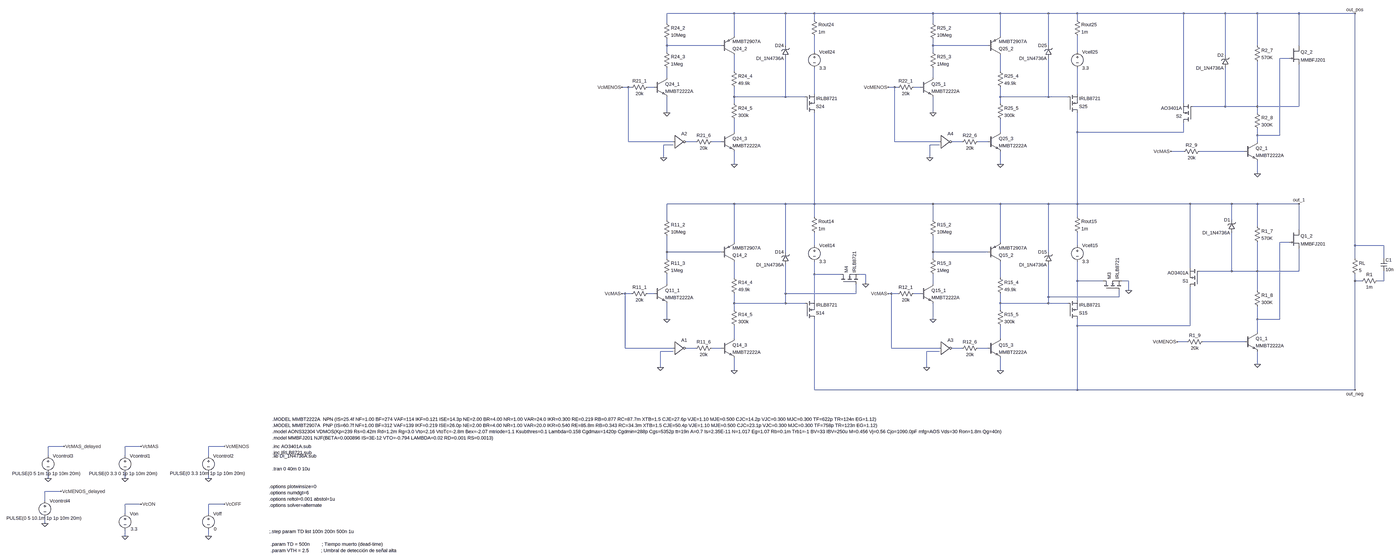
[diagram p0: schematic Matriz2x2_con_inversores.asc, whole sheet]
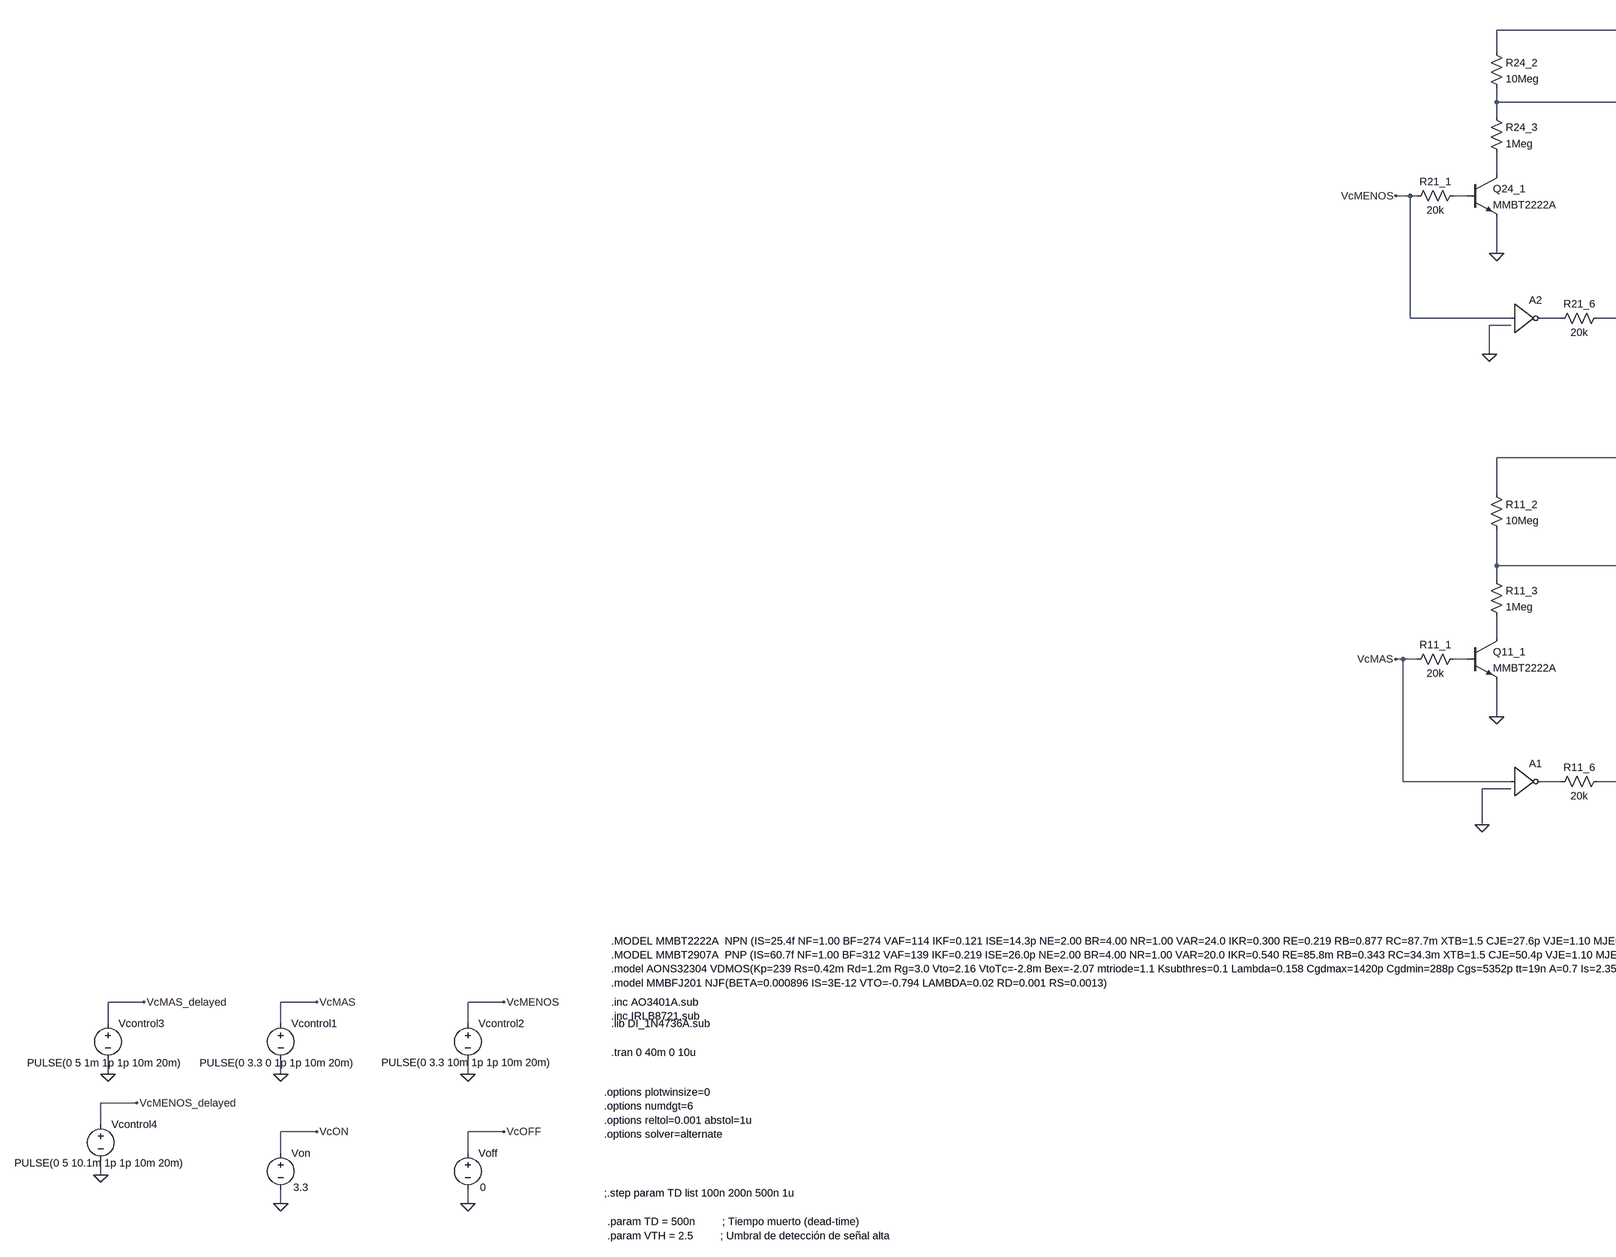
[diagram p1: schematic Matriz2x2_con_inversores.asc, part, row 1 of 1, column 1 of 2]
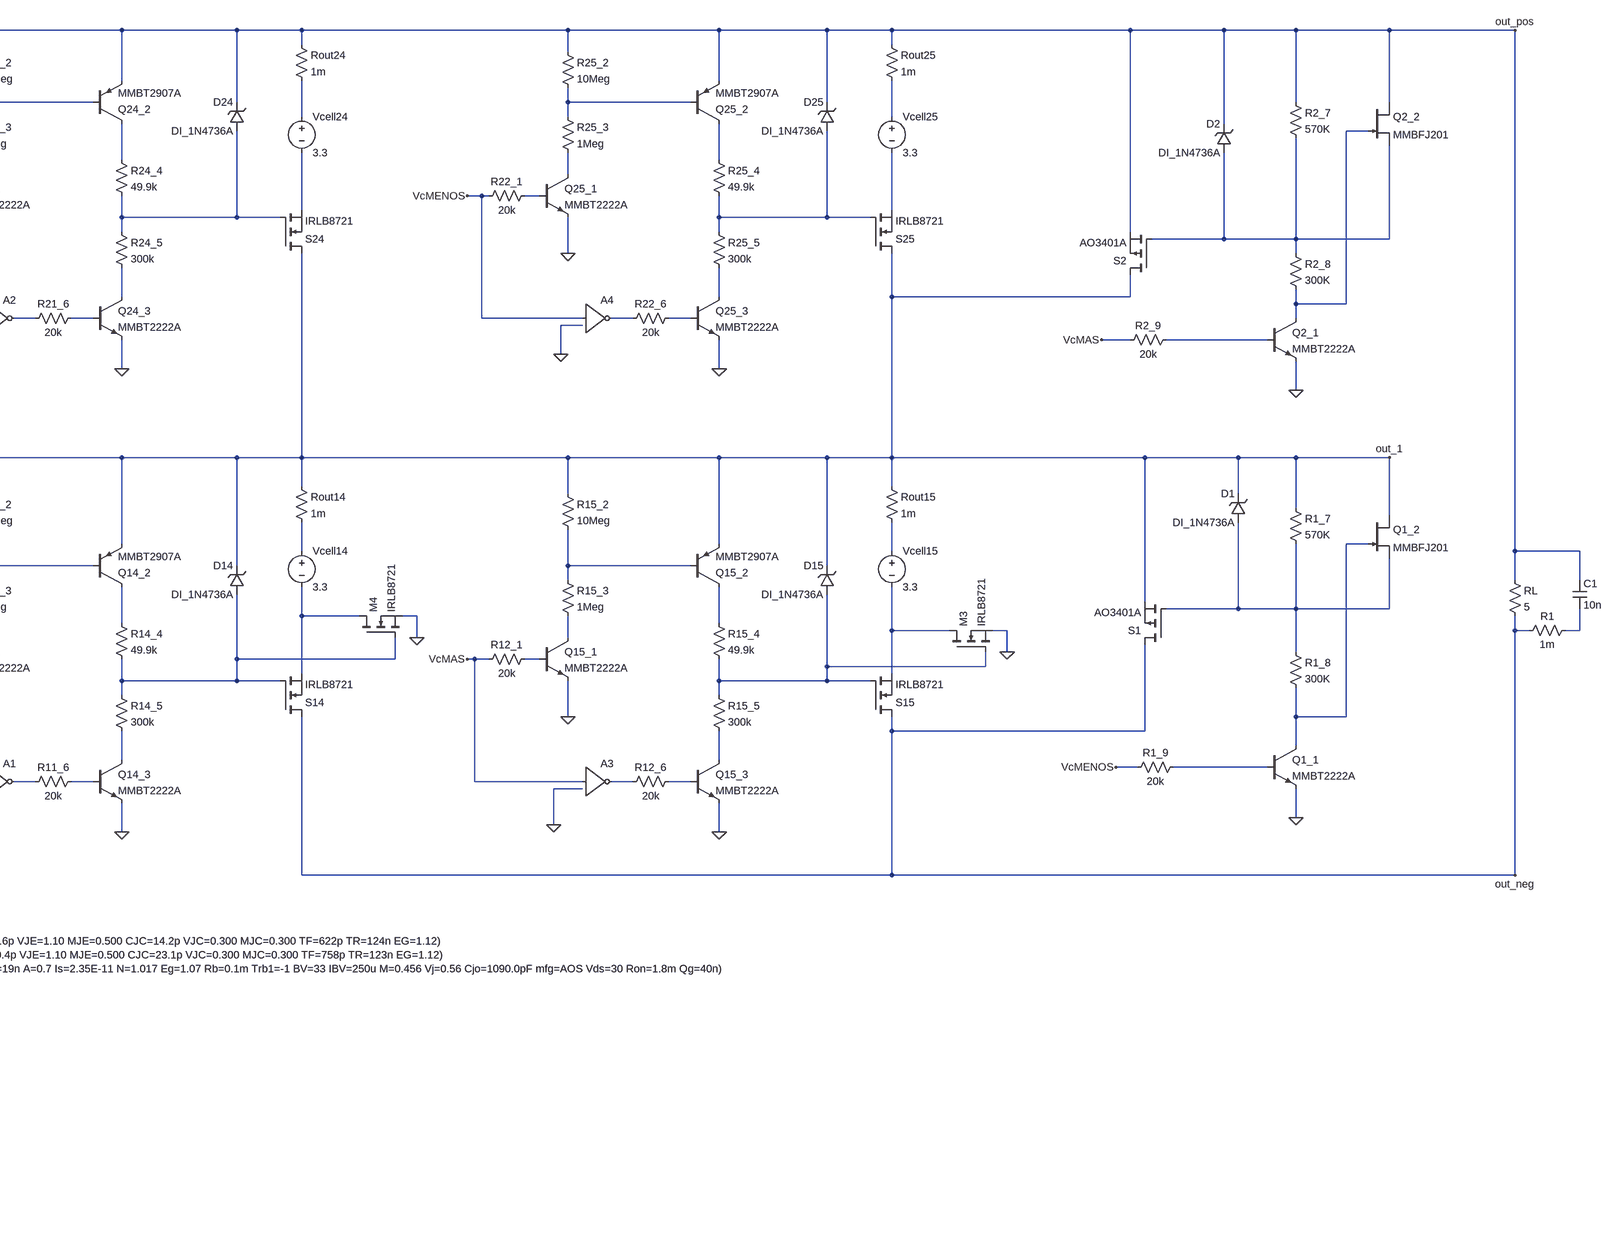
[diagram p2: schematic Matriz2x2_con_inversores.asc, part, row 1 of 1, column 2 of 2]
Matriz2x2_con_inversores.asc, the LTspice schematic file:
Version 4.1
SHEET 1 5536 2128
WIRE -800 -1456 -1136 -1456
WIRE -544 -1456 -800 -1456
WIRE -400 -1456 -544 -1456
WIRE 192 -1456 -400 -1456
WIRE 528 -1456 192 -1456
WIRE 768 -1456 528 -1456
WIRE 912 -1456 768 -1456
WIRE 1712 -1456 912 -1456
WIRE 1920 -1456 1712 -1456
WIRE 2080 -1456 1920 -1456
WIRE 2288 -1456 2080 -1456
WIRE 2592 -1456 2288 -1456
WIRE -400 -1424 -400 -1456
WIRE 912 -1424 912 -1456
WIRE -1136 -1408 -1136 -1456
WIRE 192 -1408 192 -1456
WIRE -800 -1344 -800 -1456
WIRE 528 -1344 528 -1456
WIRE -1136 -1296 -1136 -1328
WIRE -864 -1296 -1136 -1296
WIRE -544 -1296 -544 -1456
WIRE 192 -1296 192 -1328
WIRE 464 -1296 192 -1296
WIRE 768 -1296 768 -1456
WIRE 2080 -1296 2080 -1456
WIRE 2288 -1296 2288 -1456
WIRE -1136 -1264 -1136 -1296
WIRE -400 -1264 -400 -1344
WIRE 192 -1264 192 -1296
WIRE 912 -1264 912 -1344
WIRE 1920 -1248 1920 -1456
WIRE 2240 -1232 2192 -1232
WIRE -800 -1168 -800 -1248
WIRE 528 -1168 528 -1248
WIRE -1136 -1136 -1136 -1184
WIRE 192 -1136 192 -1184
WIRE -1328 -1088 -1360 -1088
WIRE -1312 -1088 -1328 -1088
WIRE -1200 -1088 -1232 -1088
WIRE 0 -1088 -32 -1088
WIRE 16 -1088 0 -1088
WIRE 128 -1088 96 -1088
WIRE -400 -1056 -400 -1184
WIRE 912 -1056 912 -1184
WIRE -800 -1040 -800 -1088
WIRE -544 -1040 -544 -1232
WIRE -544 -1040 -800 -1040
WIRE -448 -1040 -544 -1040
WIRE 528 -1040 528 -1088
WIRE 768 -1040 768 -1232
WIRE 768 -1040 528 -1040
WIRE 864 -1040 768 -1040
WIRE -800 -1008 -800 -1040
WIRE 528 -1008 528 -1040
WIRE 1712 -1008 1712 -1456
WIRE 1920 -992 1920 -1184
WIRE 1920 -992 1760 -992
WIRE 2080 -992 2080 -1216
WIRE 2080 -992 1920 -992
WIRE 2288 -992 2288 -1200
WIRE 2288 -992 2080 -992
WIRE -1136 -960 -1136 -1040
WIRE 192 -960 192 -1040
WIRE 2080 -960 2080 -992
WIRE -800 -864 -800 -928
WIRE 528 -864 528 -928
WIRE 912 -864 912 -960
WIRE 1712 -864 1712 -912
WIRE 1712 -864 912 -864
WIRE 2080 -848 2080 -880
WIRE 2192 -848 2192 -1232
WIRE 2192 -848 2080 -848
WIRE -1328 -816 -1328 -1088
WIRE -1104 -816 -1328 -816
WIRE -992 -816 -1040 -816
WIRE -864 -816 -912 -816
WIRE 0 -816 0 -1088
WIRE 224 -816 0 -816
WIRE 336 -816 288 -816
WIRE 464 -816 416 -816
WIRE 2080 -816 2080 -848
WIRE -1104 -800 -1152 -800
WIRE 224 -800 176 -800
WIRE 1712 -768 1648 -768
WIRE 2016 -768 1792 -768
WIRE -1152 -736 -1152 -800
WIRE 176 -736 176 -800
WIRE -800 -704 -800 -768
WIRE 528 -704 528 -768
WIRE 2080 -656 2080 -720
WIRE -800 -368 -1136 -368
WIRE -544 -368 -800 -368
WIRE -400 -368 -400 -960
WIRE -400 -368 -544 -368
WIRE 192 -368 -400 -368
WIRE 528 -368 192 -368
WIRE 768 -368 528 -368
WIRE 912 -368 912 -864
WIRE 912 -368 768 -368
WIRE 1744 -368 912 -368
WIRE 1952 -368 1744 -368
WIRE 2080 -368 1952 -368
WIRE 2288 -368 2080 -368
WIRE -400 -304 -400 -368
WIRE 912 -304 912 -368
WIRE -1136 -288 -1136 -368
WIRE 192 -288 192 -368
WIRE 1952 -288 1952 -368
WIRE 2080 -256 2080 -368
WIRE 2288 -240 2288 -368
WIRE -800 -176 -800 -368
WIRE 528 -176 528 -368
WIRE 2240 -176 2192 -176
WIRE -400 -160 -400 -224
WIRE 912 -160 912 -224
WIRE 2592 -160 2592 -1456
WIRE 2736 -160 2592 -160
WIRE -1136 -128 -1136 -208
WIRE -864 -128 -1136 -128
WIRE -544 -128 -544 -368
WIRE 192 -128 192 -208
WIRE 464 -128 192 -128
WIRE 768 -128 768 -368
WIRE -1136 -96 -1136 -128
WIRE 192 -96 192 -128
WIRE 2592 -96 2592 -160
WIRE 2736 -96 2736 -160
WIRE 1744 -48 1744 -368
WIRE 1952 -32 1952 -224
WIRE 1952 -32 1792 -32
WIRE 2080 -32 2080 -176
WIRE 2080 -32 1952 -32
WIRE 2288 -32 2288 -144
WIRE 2288 -32 2080 -32
WIRE -400 -16 -400 -80
WIRE -272 -16 -400 -16
WIRE -144 -16 -176 -16
WIRE -800 0 -800 -80
WIRE 528 0 528 -80
WIRE 912 16 912 -80
WIRE 1040 16 912 16
WIRE 1168 16 1136 16
WIRE 2592 16 2592 -16
WIRE 2624 16 2592 16
WIRE 2736 16 2736 -32
WIRE 2736 16 2704 16
WIRE -1136 32 -1136 -16
WIRE -144 32 -144 -16
WIRE 192 32 192 -16
WIRE 1168 64 1168 16
WIRE 2080 64 2080 -32
WIRE -1344 80 -1360 80
WIRE -1312 80 -1344 80
WIRE -1200 80 -1232 80
WIRE -544 80 -544 -64
WIRE -192 80 -192 32
WIRE -192 80 -544 80
WIRE -16 80 -32 80
WIRE 16 80 -16 80
WIRE 128 80 96 80
WIRE 768 96 768 -64
WIRE 1120 96 1120 64
WIRE 1120 96 768 96
WIRE -400 112 -400 -16
WIRE 912 112 912 16
WIRE -800 128 -800 80
WIRE -544 128 -544 80
WIRE -544 128 -800 128
WIRE -448 128 -544 128
WIRE 528 128 528 80
WIRE 768 128 768 96
WIRE 768 128 528 128
WIRE 864 128 768 128
WIRE -800 160 -800 128
WIRE 528 160 528 128
WIRE -1136 208 -1136 128
WIRE 192 208 192 128
WIRE 2080 208 2080 144
WIRE 2192 208 2192 -176
WIRE 2192 208 2080 208
WIRE 912 240 912 208
WIRE 1744 240 1744 48
WIRE 1744 240 912 240
WIRE 2080 272 2080 208
WIRE -800 304 -800 240
WIRE 528 304 528 240
WIRE 1728 320 1680 320
WIRE 2016 320 1808 320
WIRE -1344 352 -1344 80
WIRE -1104 352 -1344 352
WIRE -992 352 -1040 352
WIRE -864 352 -912 352
WIRE -16 352 -16 80
WIRE 224 352 -16 352
WIRE 336 352 288 352
WIRE 464 352 416 352
WIRE -1104 368 -1168 368
WIRE 224 368 160 368
WIRE 2080 432 2080 368
WIRE -1168 448 -1168 368
WIRE 160 448 160 368
WIRE -800 464 -800 400
WIRE 528 464 528 400
WIRE -400 560 -400 208
WIRE 912 560 912 240
WIRE 912 560 -400 560
WIRE 2592 560 2592 16
WIRE 2592 560 912 560
WIRE -4336 992 -4416 992
WIRE -3952 992 -4032 992
WIRE -3536 992 -3616 992
WIRE -4416 1040 -4416 992
WIRE -4032 1040 -4032 992
WIRE -3616 1040 -3616 992
WIRE -4416 1152 -4416 1120
WIRE -4032 1152 -4032 1120
WIRE -3616 1152 -3616 1120
WIRE -4352 1216 -4432 1216
WIRE -4432 1264 -4432 1216
WIRE -3952 1280 -4032 1280
WIRE -3536 1280 -3616 1280
WIRE -4032 1328 -4032 1280
WIRE -3616 1328 -3616 1280
WIRE -4432 1376 -4432 1344
WIRE -4032 1440 -4032 1408
WIRE -3616 1440 -3616 1408
FLAG -1136 208 0
FLAG -800 464 0
FLAG 192 208 0
FLAG 528 464 0
FLAG -1136 -960 0
FLAG -800 -704 0
FLAG 192 -960 0
FLAG 528 -704 0
FLAG -4032 1152 0
FLAG -3616 1152 0
FLAG -3952 992 VcMAS
FLAG -3536 992 VcMENOS
FLAG -3616 1440 0
FLAG -3536 1280 VcOFF
FLAG -4032 1440 0
FLAG -3952 1280 VcON
FLAG -1360 80 VcMAS
FLAG -1360 -1088 VcMENOS
FLAG -32 -1088 VcMENOS
FLAG -32 80 VcMAS
FLAG 2592 560 out_neg
FLAG 2288 -368 out_1
FLAG 2080 432 0
FLAG 1680 320 VcMENOS
FLAG 2080 -656 0
FLAG 1648 -768 VcMAS
FLAG 2592 -1456 out_pos
FLAG -4416 1152 0
FLAG -4336 992 VcMAS_delayed
FLAG -4432 1376 0
FLAG -4352 1216 VcMENOS_delayed
FLAG 1168 64 0
FLAG -144 32 0
FLAG -1168 448 0
FLAG -1152 -736 0
FLAG 160 448 0
FLAG 176 -736 0
SYMBOL npn -864 304 R0
SYMATTR InstName Q14_3
SYMATTR Value MMBT2222A
SYMBOL res -816 144 R0
SYMATTR InstName R14_5
SYMATTR Value 300k
SYMBOL res -816 -16 R0
SYMATTR InstName R14_4
SYMATTR Value 49.9k
SYMBOL npn -1200 32 R0
SYMATTR InstName Q11_1
SYMATTR Value MMBT2222A
SYMBOL res -1152 -112 R0
SYMATTR InstName R11_3
SYMATTR Value 1Meg
SYMBOL res -1152 -304 R0
SYMATTR InstName R11_2
SYMATTR Value 10Meg
SYMBOL res -896 336 R90
WINDOW 0 0 56 VBottom 2
WINDOW 3 32 56 VTop 2
SYMATTR InstName R11_6
SYMATTR Value 20k
SYMBOL voltage -400 -176 R0
WINDOW 123 0 0 Left 0
WINDOW 39 0 0 Left 0
SYMATTR InstName Vcell14
SYMATTR Value 3.3
SYMBOL pnp -864 -80 M180
SYMATTR InstName Q14_2
SYMATTR Value MMBT2907A
SYMBOL nmos -448 208 M180
SYMATTR InstName S14
SYMATTR Value IRLB8721
SYMATTR Prefix X
SYMBOL npn 464 304 R0
SYMATTR InstName Q15_3
SYMATTR Value MMBT2222A
SYMBOL res 512 144 R0
SYMATTR InstName R15_5
SYMATTR Value 300k
SYMBOL res 512 -16 R0
SYMATTR InstName R15_4
SYMATTR Value 49.9k
SYMBOL npn 128 32 R0
SYMATTR InstName Q15_1
SYMATTR Value MMBT2222A
SYMBOL res 176 -112 R0
SYMATTR InstName R15_3
SYMATTR Value 1Meg
SYMBOL res 176 -304 R0
SYMATTR InstName R15_2
SYMATTR Value 10Meg
SYMBOL res 432 336 R90
WINDOW 0 0 56 VBottom 2
WINDOW 3 32 56 VTop 2
SYMATTR InstName R12_6
SYMATTR Value 20k
SYMBOL voltage 912 -176 R0
WINDOW 123 0 0 Left 0
WINDOW 39 0 0 Left 0
SYMATTR InstName Vcell15
SYMATTR Value 3.3
SYMBOL pnp 464 -80 M180
SYMATTR InstName Q15_2
SYMATTR Value MMBT2907A
SYMBOL nmos 864 208 M180
SYMATTR InstName S15
SYMATTR Value IRLB8721
SYMATTR Prefix X
SYMBOL npn -864 -864 R0
SYMATTR InstName Q24_3
SYMATTR Value MMBT2222A
SYMBOL res -816 -1024 R0
SYMATTR InstName R24_5
SYMATTR Value 300k
SYMBOL res -816 -1184 R0
SYMATTR InstName R24_4
SYMATTR Value 49.9k
SYMBOL npn -1200 -1136 R0
SYMATTR InstName Q24_1
SYMATTR Value MMBT2222A
SYMBOL res -1152 -1280 R0
SYMATTR InstName R24_3
SYMATTR Value 1Meg
SYMBOL res -1152 -1424 R0
SYMATTR InstName R24_2
SYMATTR Value 10Meg
SYMBOL res -896 -832 R90
WINDOW 0 0 56 VBottom 2
WINDOW 3 32 56 VTop 2
SYMATTR InstName R21_6
SYMATTR Value 20k
SYMBOL voltage -400 -1280 R0
WINDOW 123 0 0 Left 0
WINDOW 39 0 0 Left 0
SYMATTR InstName Vcell24
SYMATTR Value 3.3
SYMBOL pnp -864 -1248 M180
SYMATTR InstName Q24_2
SYMATTR Value MMBT2907A
SYMBOL nmos -448 -960 M180
SYMATTR InstName S24
SYMATTR Value IRLB8721
SYMATTR Prefix X
SYMBOL npn 464 -864 R0
SYMATTR InstName Q25_3
SYMATTR Value MMBT2222A
SYMBOL res 512 -1024 R0
SYMATTR InstName R25_5
SYMATTR Value 300k
SYMBOL res 512 -1184 R0
SYMATTR InstName R25_4
SYMATTR Value 49.9k
SYMBOL npn 128 -1136 R0
SYMATTR InstName Q25_1
SYMATTR Value MMBT2222A
SYMBOL res 176 -1280 R0
SYMATTR InstName R25_3
SYMATTR Value 1Meg
SYMBOL res 176 -1424 R0
SYMATTR InstName R25_2
SYMATTR Value 10Meg
SYMBOL res 432 -832 R90
WINDOW 0 0 56 VBottom 2
WINDOW 3 32 56 VTop 2
SYMATTR InstName R22_6
SYMATTR Value 20k
SYMBOL voltage 912 -1280 R0
WINDOW 123 0 0 Left 0
WINDOW 39 0 0 Left 0
SYMATTR InstName Vcell25
SYMATTR Value 3.3
SYMBOL pnp 464 -1248 M180
SYMATTR InstName Q25_2
SYMATTR Value MMBT2907A
SYMBOL nmos 864 -960 M180
SYMATTR InstName S25
SYMATTR Value IRLB8721
SYMATTR Prefix X
SYMBOL voltage -4032 1024 R0
WINDOW 3 -180 103 Left 2
WINDOW 123 0 0 Left 0
WINDOW 39 0 0 Left 0
SYMATTR Value PULSE(0 3.3 0 1p 1p 10m 20m)
SYMATTR InstName Vcontrol1
SYMBOL voltage -3616 1024 R0
WINDOW 3 -192 102 Left 2
WINDOW 123 0 0 Left 0
WINDOW 39 0 0 Left 0
SYMATTR Value PULSE(0 3.3 10m 1p 1p 10m 20m)
SYMATTR InstName Vcontrol2
SYMBOL voltage -3616 1312 R0
WINDOW 3 27 92 Left 2
WINDOW 123 0 0 Left 0
WINDOW 39 0 0 Left 0
SYMATTR Value 0
SYMATTR InstName Voff
SYMBOL voltage -4032 1312 R0
WINDOW 3 28 92 Left 2
WINDOW 123 0 0 Left 0
WINDOW 39 0 0 Left 0
SYMATTR Value 3.3
SYMATTR InstName Von
SYMBOL res -1216 64 R90
WINDOW 0 0 56 VBottom 2
WINDOW 3 32 56 VTop 2
SYMATTR InstName R11_1
SYMATTR Value 20k
SYMBOL res -1216 -1104 R90
WINDOW 0 0 56 VBottom 2
WINDOW 3 32 56 VTop 2
SYMATTR InstName R21_1
SYMATTR Value 20k
SYMBOL res 112 -1104 R90
WINDOW 0 0 56 VBottom 2
WINDOW 3 32 56 VTop 2
SYMATTR InstName R22_1
SYMATTR Value 20k
SYMBOL res 112 64 R90
WINDOW 0 0 56 VBottom 2
WINDOW 3 32 56 VTop 2
SYMATTR InstName R12_1
SYMATTR Value 20k
SYMBOL res 2576 -112 R0
SYMATTR InstName RL
SYMATTR Value 5
SYMBOL res 896 -320 R0
SYMATTR InstName Rout15
SYMATTR Value 1m
SYMBOL res -416 -320 R0
SYMATTR InstName Rout14
SYMATTR Value 1m
SYMBOL res -416 -1440 R0
SYMATTR InstName Rout24
SYMATTR Value 1m
SYMBOL res 896 -1440 R0
SYMATTR InstName Rout25
SYMATTR Value 1m
SYMBOL npn 2016 272 R0
SYMATTR InstName Q1_1
SYMATTR Value MMBT2222A
SYMBOL res 1824 304 R90
WINDOW 0 0 56 VBottom 2
WINDOW 3 32 56 VTop 2
SYMATTR InstName R1_9
SYMATTR Value 20k
SYMBOL res 2064 48 R0
SYMATTR InstName R1_8
SYMATTR Value 300K
SYMBOL res 2064 -272 R0
SYMATTR InstName R1_7
SYMATTR Value 570K
SYMBOL npn 2016 -816 R0
SYMATTR InstName Q2_1
SYMATTR Value MMBT2222A
SYMBOL res 1808 -784 R90
WINDOW 0 0 56 VBottom 2
WINDOW 3 32 56 VTop 2
SYMATTR InstName R2_9
SYMATTR Value 20k
SYMBOL res 2064 -976 R0
SYMATTR InstName R2_8
SYMATTR Value 300K
SYMBOL res 2064 -1312 R0
SYMATTR InstName R2_7
SYMATTR Value 570K
SYMBOL pmos 1792 48 R180
SYMATTR InstName S1
SYMATTR Value AO3401A
SYMATTR Prefix X
SYMBOL pmos 1760 -912 R180
SYMATTR InstName S2
SYMATTR Value AO3401A
SYMATTR Prefix X
SYMBOL njf 2240 -240 R0
SYMATTR InstName Q1_2
SYMATTR Value MMBFJ201
SYMBOL njf 2240 -1296 R0
SYMATTR InstName Q2_2
SYMATTR Value MMBFJ201
SYMBOL zener 1936 -1184 R180
WINDOW 0 24 64 Left 2
WINDOW 3 24 0 Left 2
SYMATTR InstName D2
SYMATTR Value DI_1N4736A
SYMATTR Prefix x
SYMBOL zener 784 -1232 R180
WINDOW 0 24 64 Left 2
WINDOW 3 24 0 Left 2
SYMATTR InstName D25
SYMATTR Value DI_1N4736A
SYMATTR Prefix X
SYMBOL zener -528 -1232 R180
WINDOW 0 24 64 Left 2
WINDOW 3 24 0 Left 2
SYMATTR InstName D24
SYMATTR Value DI_1N4736A
SYMATTR Prefix X
SYMBOL zener -528 -64 R180
WINDOW 0 24 64 Left 2
WINDOW 3 24 0 Left 2
SYMATTR InstName D14
SYMATTR Value DI_1N4736A
SYMATTR Prefix X
SYMBOL zener 784 -64 R180
WINDOW 0 24 64 Left 2
WINDOW 3 24 0 Left 2
SYMATTR InstName D15
SYMATTR Value DI_1N4736A
SYMATTR Prefix X
SYMBOL zener 1968 -224 R180
WINDOW 0 24 64 Left 2
WINDOW 3 24 0 Left 2
SYMATTR InstName D1
SYMATTR Value DI_1N4736A
SYMATTR Prefix x
SYMBOL voltage -4416 1024 R0
WINDOW 3 -180 103 Left 2
WINDOW 123 0 0 Left 0
WINDOW 39 0 0 Left 0
SYMATTR Value PULSE(0 5 1m 1p 1p 10m 20m)
SYMATTR InstName Vcontrol3
SYMBOL voltage -4432 1248 R0
WINDOW 3 -192 102 Left 2
WINDOW 123 0 0 Left 0
WINDOW 39 0 0 Left 0
SYMATTR Value PULSE(0 5 10.1m 1p 1p 10m 20m)
SYMATTR InstName Vcontrol4
SYMBOL nmos 1040 64 R270
SYMATTR InstName M3
SYMATTR Value IRLB8721
SYMATTR Prefix X
SYMBOL nmos -272 32 R270
SYMATTR InstName M4
SYMATTR Value IRLB8721
SYMATTR Prefix X
SYMBOL Digital\\inv -1104 288 R0
SYMATTR InstName A1
SYMBOL Digital\\inv -1104 -880 R0
SYMATTR InstName A2
SYMBOL Digital\\inv 224 288 R0
SYMATTR InstName A3
SYMBOL Digital\\inv 224 -880 R0
SYMATTR InstName A4
SYMBOL cap 2720 -96 R0
SYMATTR InstName C1
SYMATTR Value 10n
SYMBOL res 2720 0 R90
WINDOW 0 0 56 VBottom 2
WINDOW 3 32 56 VTop 2
SYMATTR InstName R1
SYMATTR Value 1m
TEXT -3104 1104 Left 2 !.tran 0 40m 0 10u
TEXT -3104 856 Left 2 !.MODEL MMBT2222A  NPN (IS=25.4f NF=1.00 BF=274 VAF=114 IKF=0.121 ISE=14.3p NE=2.00 BR=4.00 NR=1.00 VAR=24.0 IKR=0.300 RE=0.219 RB=0.877 RC=87.7m XTB=1.5 CJE=27.6p VJE=1.10 MJE=0.500 CJC=14.2p VJC=0.300 MJC=0.300 TF=622p TR=124n EG=1.12)\n.MODEL MMBT2907A  PNP (IS=60.7f NF=1.00 BF=312 VAF=139 IKF=0.219 ISE=26.0p NE=2.00 BR=4.00 NR=1.00 VAR=20.0 IKR=0.540 RE=85.8m RB=0.343 RC=34.3m XTB=1.5 CJE=50.4p VJE=1.10 MJE=0.500 CJC=23.1p VJC=0.300 MJC=0.300 TF=758p TR=123n EG=1.12)\n.model AONS32304 VDMOS(Kp=239 Rs=0.42m Rd=1.2m Rg=3.0 Vto=2.16 VtoTc=-2.8m Bex=-2.07 mtriode=1.1 Ksubthres=0.1 Lambda=0.158 Cgdmax=1420p Cgdmin=288p Cgs=5352p tt=19n A=0.7 Is=2.35E-11 N=1.017 Eg=1.07 Rb=0.1m Trb1=-1 BV=33 IBV=250u M=0.456 Vj=0.56 Cjo=1090.0pF mfg=AOS Vds=30 Ron=1.8m Qg=40n)\n.model MMBFJ201 NJF(BETA=0.000896 IS=3E-12 VTO=-0.794 LAMBDA=0.02 RD=0.001 RS=0.0013)
TEXT -3104 992 Left 2 !.inc AO3401A.sub\n.inc IRLB8721.sub
TEXT -3104 1040 Left 2 !.lib DI_1N4736A.sub
TEXT -3120 1192 Left 2 !.options plotwinsize=0\n.options numdgt=6\n.options reltol=0.001 abstol=1u\n.options solver=alternate
TEXT -3120 1416 Left 2 !;.step param TD list 100n 200n 500n 1u
TEXT -3112 1480 Left 2 !.param TD = 500n         ; Tiempo muerto (dead-time)\n.param VTH = 2.5         ; Umbral de detección de señal alta

The netlist it stands for:
* Matriz2x2_con_inversores.asc
Q14_3 N041 N045 0 0 MMBT2222A
R14_5 N038 N041 300k
R14_4 N031 N038 49.9k
Q11_1 N035 N037 0 0 MMBT2222A
R11_3 N027 N035 1Meg
R11_2 out_1 N027 10Meg
R11_6 N045 N044 20k
Vcell14 N025 N030 3.3
Q14_2 N031 N027 out_1 0 MMBT2907A
X§S14 out_neg N038 N030 IRLB8721  ; pins D G S
Q15_3 N042 N047 0 0 MMBT2222A
R15_5 N040 N042 300k
R15_4 N032 N040 49.9k
Q15_1 N036 N039 0 0 MMBT2222A
R15_3 N028 N036 1Meg
R15_2 out_1 N028 10Meg
R12_6 N047 N046 20k
Vcell15 N026 N033 3.3
Q15_2 N032 N028 out_1 0 MMBT2907A
X§S15 out_neg N040 N033 IRLB8721  ; pins D G S
Q24_3 N017 N020 0 0 MMBT2222A
R24_5 N014 N017 300k
R24_4 N006 N014 49.9k
Q24_1 N008 N010 0 0 MMBT2222A
R24_3 N001 N008 1Meg
R24_2 out_pos N001 10Meg
R21_6 N020 N019 20k
Vcell24 N003 N012 3.3
Q24_2 N006 N001 out_pos 0 MMBT2907A
X§S24 out_1 N014 N012 IRLB8721  ; pins D G S
Q25_3 N018 N022 0 0 MMBT2222A
R25_5 N015 N018 300k
R25_4 N007 N015 49.9k
Q25_1 N009 N011 0 0 MMBT2222A
R25_3 N002 N009 1Meg
R25_2 out_pos N002 10Meg
R22_6 N022 N021 20k
Vcell25 N004 N013 3.3
Q25_2 N007 N002 out_pos 0 MMBT2907A
X§S25 out_1 N015 N013 IRLB8721  ; pins D G S
Vcontrol1 VcMAS 0 PULSE(0 3.3 0 1p 1p 10m 20m)
Vcontrol2 VcMENOS 0 PULSE(0 3.3 10m 1p 1p 10m 20m)
Voff VcOFF 0 0
Von VcON 0 3.3
R11_1 N037 VcMAS 20k
R21_1 N010 VcMENOS 20k
R22_1 N011 VcMENOS 20k
R12_1 N039 VcMAS 20k
RL out_pos out_neg 5
Rout15 out_1 N026 1m
Rout14 out_1 N025 1m
Rout24 out_pos N003 1m
Rout25 out_pos N004 1m
Q1_1 N024 N043 0 0 MMBT2222A
R1_9 N043 VcMENOS 20k
R1_8 N029 N024 300K
R1_7 out_1 N029 570K
Q2_1 N005 N023 0 0 MMBT2222A
R2_9 N023 VcMAS 20k
R2_8 N016 N005 300K
R2_7 out_pos N016 570K
X§S1 out_neg N029 out_1 AO3401A  ; pins D G S
X§S2 out_1 N016 out_pos AO3401A  ; pins D G S
J§Q1_2 out_1 N024 N029 MMBFJ201
J§Q2_2 out_pos N005 N016 MMBFJ201
X§D2 N016 out_pos DI_1N4736A  ; pins + -
X§D25 N015 out_pos DI_1N4736A  ; pins + -
X§D24 N014 out_pos DI_1N4736A  ; pins + -
X§D14 N038 out_1 DI_1N4736A  ; pins + -
X§D15 N040 out_1 DI_1N4736A  ; pins + -
X§D1 N029 out_1 DI_1N4736A  ; pins + -
Vcontrol3 VcMAS_delayed 0 PULSE(0 5 1m 1p 1p 10m 20m)
Vcontrol4 VcMENOS_delayed 0 PULSE(0 5 10.1m 1p 1p 10m 20m)
X§M3 N033 N040 0 IRLB8721  ; pins D G S
X§M4 N030 N038 0 IRLB8721  ; pins D G S
A1 VcMAS 0 0 0 0 N044 0 0 BUF
A2 VcMENOS 0 0 0 0 N019 0 0 BUF
A3 VcMAS 0 0 0 0 N046 0 0 BUF
A4 VcMENOS 0 0 0 0 N021 0 0 BUF
C1 out_pos N034 10n
R1 N034 out_neg 1m
.model NPN NPN
.model PNP PNP
.lib standard.bjt
.model NJF NJF
.model PJF PJF
.lib standard.jft
.tran 0 40m 0 10u
.MODEL MMBT2222A  NPN (IS=25.4f NF=1.00 BF=274 VAF=114 IKF=0.121 ISE=14.3p NE=2.00 BR=4.00 NR=1.00 VAR=24.0 IKR=0.300 RE=0.219 RB=0.877 RC=87.7m XTB=1.5 CJE=27.6p VJE=1.10 MJE=0.500 CJC=14.2p VJC=0.300 MJC=0.300 TF=622p TR=124n EG=1.12)
.MODEL MMBT2907A  PNP (IS=60.7f NF=1.00 BF=312 VAF=139 IKF=0.219 ISE=26.0p NE=2.00 BR=4.00 NR=1.00 VAR=20.0 IKR=0.540 RE=85.8m RB=0.343 RC=34.3m XTB=1.5 CJE=50.4p VJE=1.10 MJE=0.500 CJC=23.1p VJC=0.300 MJC=0.300 TF=758p TR=123n EG=1.12)
.model AONS32304 VDMOS(Kp=239 Rs=0.42m Rd=1.2m Rg=3.0 Vto=2.16 VtoTc=-2.8m Bex=-2.07 mtriode=1.1 Ksubthres=0.1 Lambda=0.158 Cgdmax=1420p Cgdmin=288p Cgs=5352p tt=19n A=0.7 Is=2.35E-11 N=1.017 Eg=1.07 Rb=0.1m Trb1=-1 BV=33 IBV=250u M=0.456 Vj=0.56 Cjo=1090.0pF mfg=AOS Vds=30 Ron=1.8m Qg=40n)
.model MMBFJ201 NJF(BETA=0.000896 IS=3E-12 VTO=-0.794 LAMBDA=0.02 RD=0.001 RS=0.0013)
.inc AO3401A.sub
.inc IRLB8721.sub
.lib DI_1N4736A.sub
.options plotwinsize=0
.options numdgt=6
.options reltol=0.001 abstol=1u
.options solver=alternate
;.step param TD list 100n 200n 500n 1u
.param TD = 500n         ; Tiempo muerto (dead-time)
.param VTH = 2.5         ; Umbral de detección de señal alta
.backanno
.end